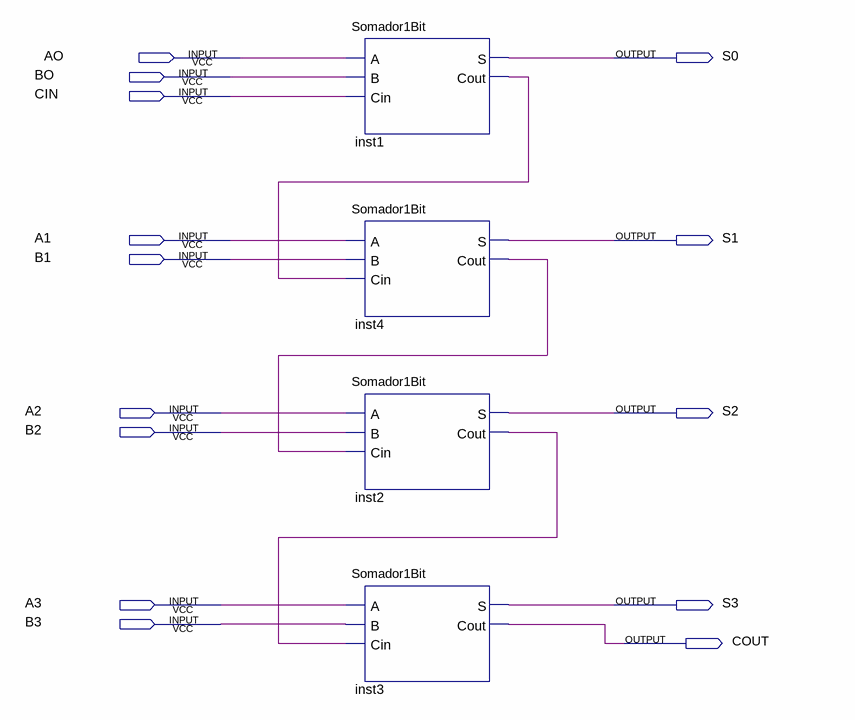
[diagram p0: schematic sheet]
// Quartus schematic Somador4bits.bdf as structural Verilog: 4 symbols, 14 pins
module Somador4bits (
  input  AO,
  input  BO,
  input  CIN,
  input  A1,
  input  B1,
  input  A2,
  input  B2,
  input  A3,
  input  B3,
  output S0,
  output S1,
  output S2,
  output S3,
  output COUT
);

  wire inst1_cout, inst2_cout, inst4_cout;

  Somador1Bit inst1 (.A(AO), .B(BO), .Cin(CIN), .S(S0), .Cout(inst1_cout));
  Somador1Bit inst4 (.A(A1), .B(B1), .Cin(inst1_cout), .S(S1), .Cout(inst4_cout));
  Somador1Bit inst2 (.A(A2), .B(B2), .Cin(inst4_cout), .S(S2), .Cout(inst2_cout));
  Somador1Bit inst3 (.A(A3), .B(B3), .Cin(inst2_cout), .S(S3), .Cout(COUT));
endmodule
